# Altium schematic sheet 14_GPIOs_1.SchDoc: Apalis Evaluation Board 1.1
size A3; Organization: Toradex AG; Address1: Altsagenstrasse 5; Address2: Horw; Address3: 6048; Address4: Switzerland; DocumentNumber: 10; Revision: V1.1; SheetNumber: 10; SheetTotal: 32; PageSetup: Record=PageOptions|CenterHorizontal=True|CenterVertical=True|PrintScale=0.73|XCorrection=1.00|YCorrection=1.00|PrintKind=0|BorderSize=5000000|LeftOffset=0|BottomOffset=0|Orientation=2|PaperLength=1000|PaperWidth=1000|Scale=100|PaperSource=7|PrintQuality=-4|MediaType=1|DitherType=10|PaperKind=A4|PrintScaleMode=1
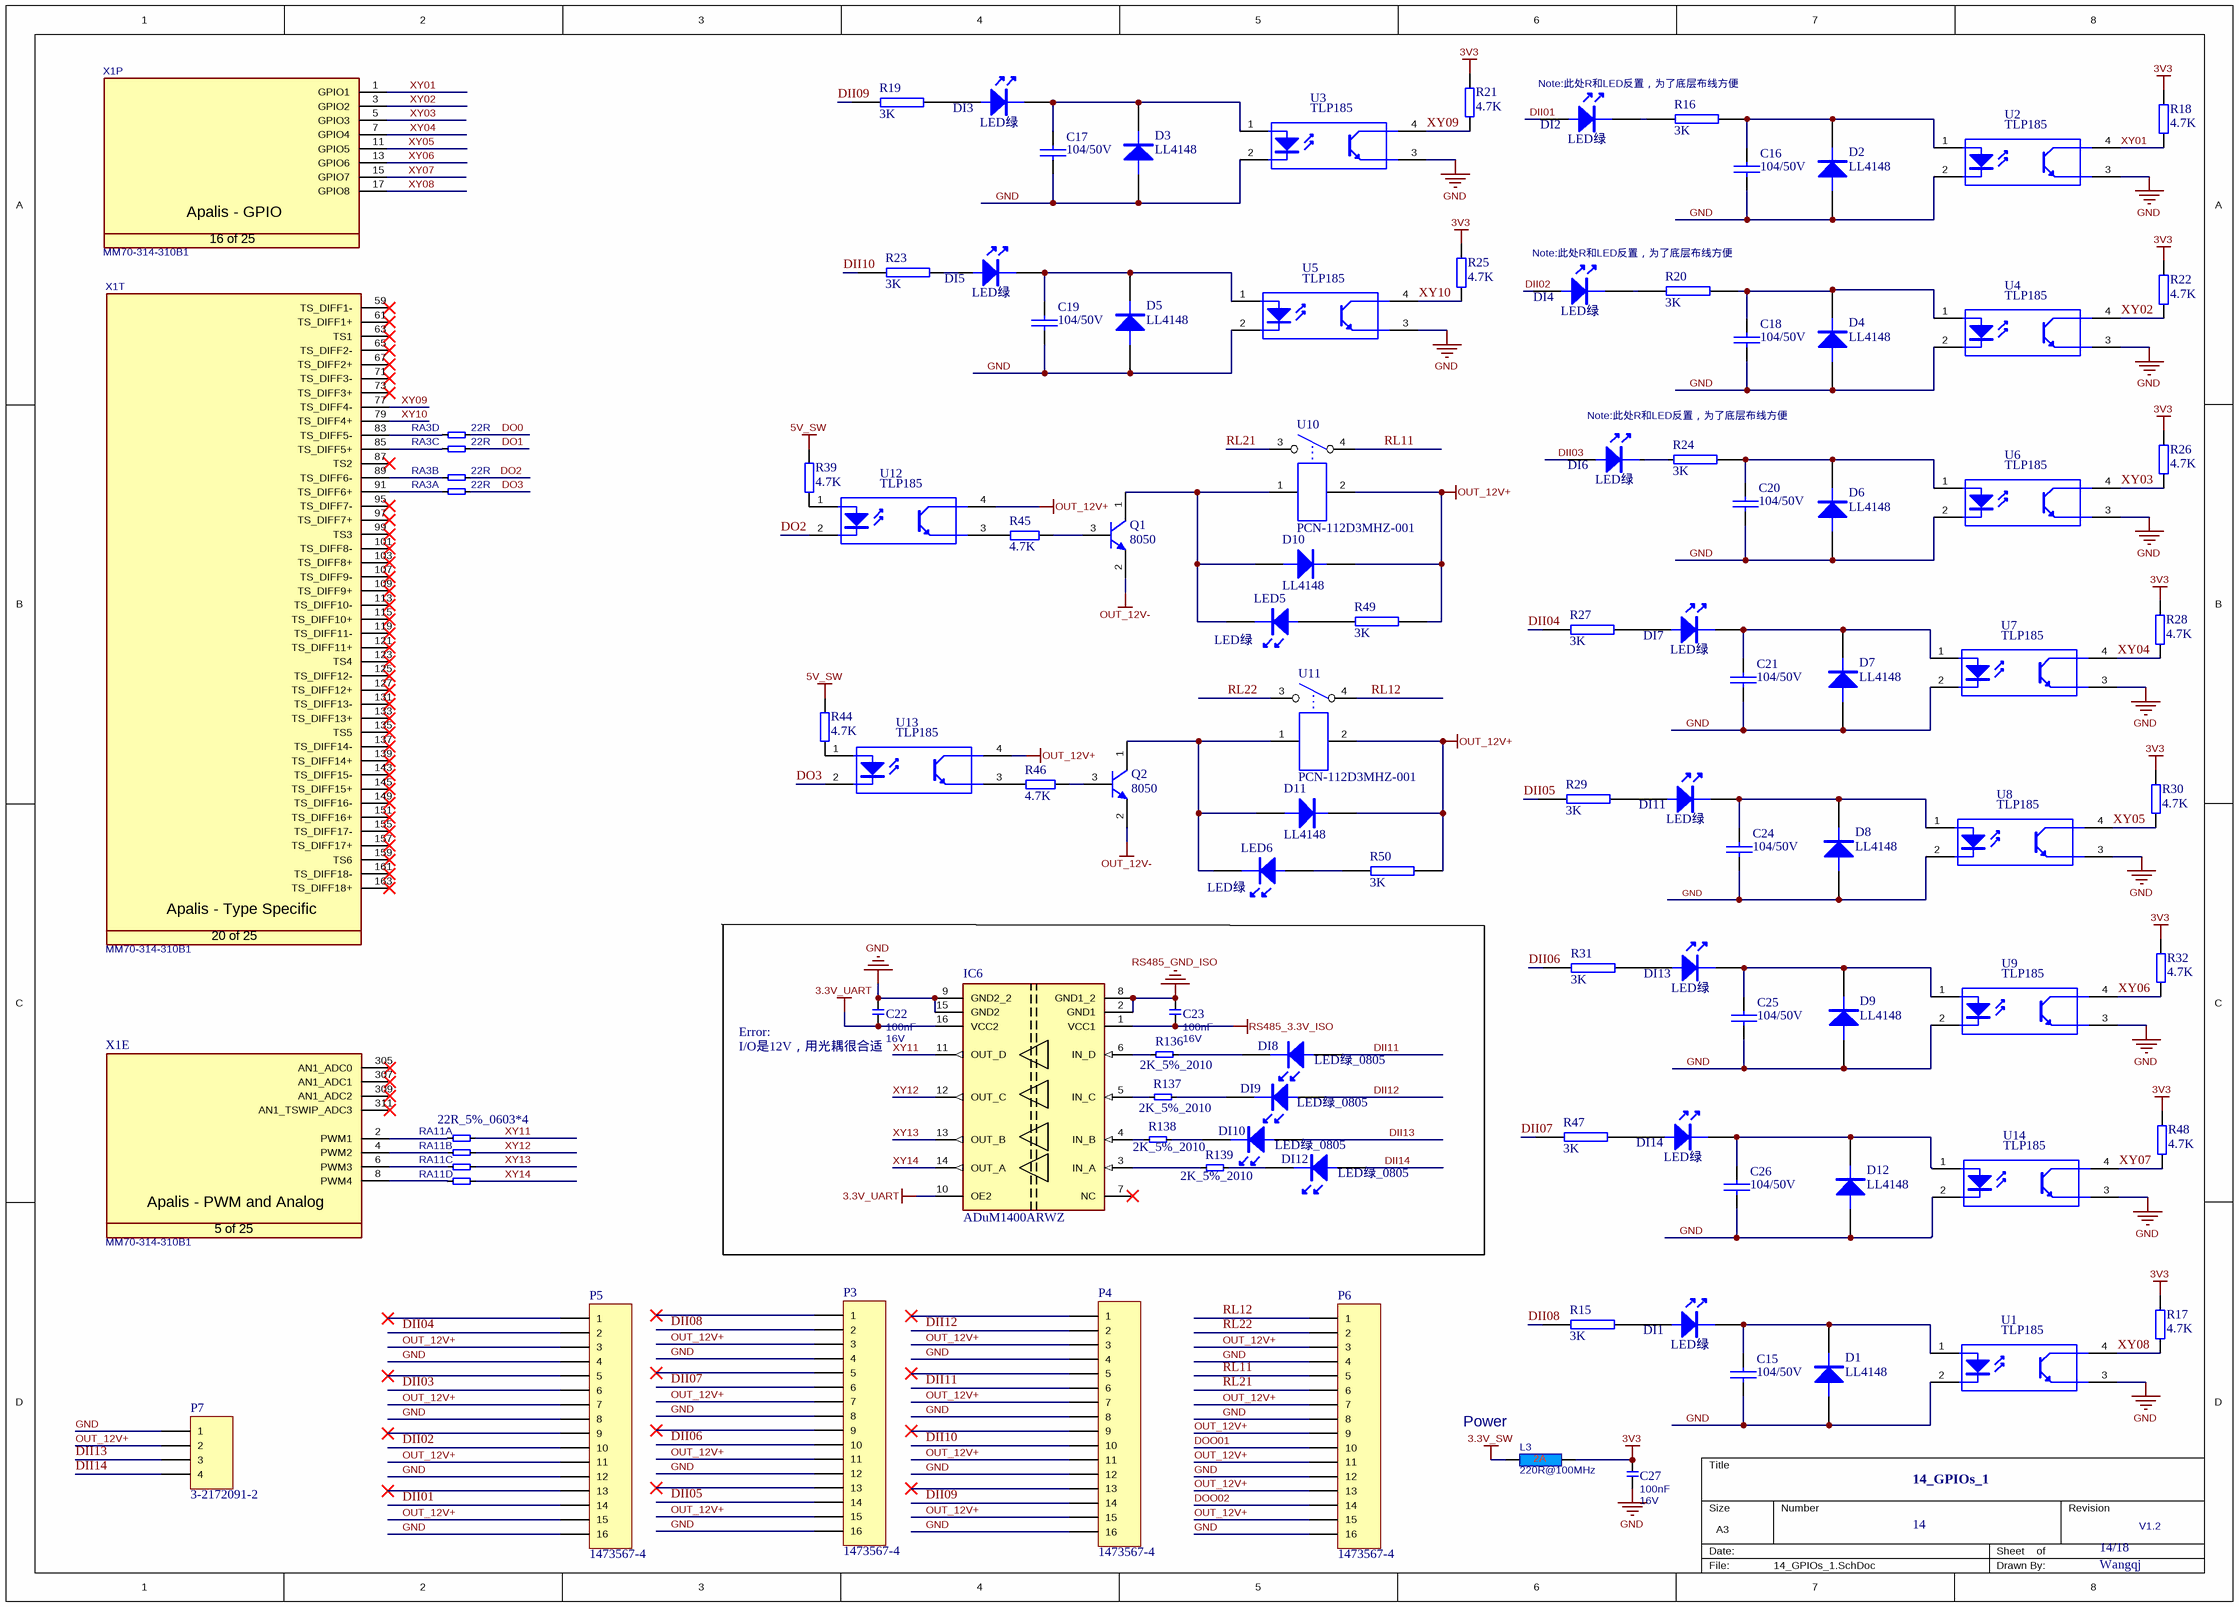
[diagram p0: 14_GPIOs_1.SchDoc]

## Parts
C15  104/50V  [0603c]
C16  104/50V  [0603c]
C17  104/50V  [0603c]
C18  104/50V  [0603c]
C19  104/50V  [0603c]
C20  104/50V  [0603c]
C21  104/50V  [0603c]
C22  Rating: 16V  [T_CAPC0603X33N]  (hidden comment: 100nF)
C23  Rating: 16V  [T_CAPC0603X33N]  (hidden comment: 100nF)
C24  104/50V  [0603c]
C25  104/50V  [0603c]
C26  104/50V  [0603c]
C27  Rating: 16V  [T_CAPC0603X33N]  (hidden comment: 100nF)
D1  LL4148  [3216]
D2  LL4148  [3216]
D3  LL4148  [3216]
D4  LL4148  [3216]
D5  LL4148  [3216]
D6  LL4148  [3216]
D7  LL4148  [3216]
D8  LL4148  [3216]
D9  LL4148  [3216]
D10  LL4148  [3216]
D11  LL4148  [3216]
D12  LL4148  [3216]
DI1  LED绿  [LC-0805_LED_S3]
DI2  LED绿  [LC-0805_LED_S3]
DI3  LED绿  [LC-0805_LED_S3]
DI4  LED绿  [LC-0805_LED_S3]
DI5  LED绿  [LC-0805_LED_S3]
DI6  LED绿  [LC-0805_LED_S3]
DI7  LED绿  [LC-0805_LED_S3]
DI8  LED绿_0805  [LC-0805_LED_S3]
DI9  LED绿_0805  [LC-0805_LED_S3]
DI10  LED绿_0805  [LC-0805_LED_S3]
DI11  LED绿  [LC-0805_LED_S3]
DI12  LED绿_0805  [LC-0805_LED_S3]
DI13  LED绿  [LC-0805_LED_S3]
DI14  LED绿  [LC-0805_LED_S3]
IC6  ADuM1400ARWZ  [T_AD_ADuM1300ARW]
L3  220R@100MHz  [INDC1608X95N]
LED5  LED绿  [LC-0805_LED_S3]
LED6  LED绿  [LC-0805_LED_S3]
P3  1473567-4  [147-4]
P4  1473567-4  [147-4]
P5  1473567-4  [147-4]
P6  1473567-4  [147-4]
P7  3-2172091-2  [M12弯角座]
Q1  8050  [SOT-23M]
Q2  8050  [SOT-23M]
R15  3K  [2010]
R16  3K  [2010]
R17  4.7K  [0603R]
R18  4.7K  [0603R]
R19  3K  [2010]
R20  3K  [2010]
R21  4.7K  [0603R]
R22  4.7K  [0603R]
R23  3K  [2010]
R24  3K  [2010]
R25  4.7K  [0603R]
R26  4.7K  [0603R]
R27  3K  [2010]
R28  4.7K  [0603R]
R29  3K  [2010]
R30  4.7K  [0603R]
R31  3K  [2010]
R32  4.7K  [0603R]
R39  4.7K  [0603R]
R44  4.7K  [0603R]
R45  4.7K  [0603R]
R46  4.7K  [0603R]
R47  3K  [2010]
R48  4.7K  [0603R]
R49  3K  [1206]
R50  3K  [1206]
R136  2K_5%_2010  [2010]
R137  2K_5%_2010  [2010]
R138  2K_5%_2010  [2010]
R139  2K_5%_2010  [2010]
RA3  22R  [T_Resistor_Array_X4]  (parts A,B,C,D of 4)
RA11  22R_5%_0603*4  [T_Resistor_Array_X4]  (parts A,B,C,D of 4)
U1  TLP185  [SO_PHT-4]
U2  TLP185  [SO_PHT-4]
U3  TLP185  [SO_PHT-4]
U4  TLP185  [SO_PHT-4]
U5  TLP185  [SO_PHT-4]
U6  TLP185  [SO_PHT-4]
U7  TLP185  [SO_PHT-4]
U8  TLP185  [SO_PHT-4]
U9  TLP185  [SO_PHT-4]
U10  PCN-112D3MHZ-001  [CRH-1C]
U11  PCN-112D3MHZ-001  [CRH-1C]
U12  TLP185  [SO_PHT-4]
U13  TLP185  [SO_PHT-4]
U14  TLP185  [SO_PHT-4]
X1  Manufacturer Part No.: MM70-314-310B1  [T_JAE_MM70-314-310B1]  (hidden comment: CON-JAE-MM70-314-310B1-314-0.5mm)  (parts E,P,T of 25)

## Nets
3.3V_SW: L3.1
3.3V_UART: C22.2 IC6.10(OE2) IC6.16(VCC2)
3V3: C27.2 L3.2 R17.2 R18.2 R21.2 R22.2 R25.2 R26.2 R28.2 R30.2 R32.2 R48.2
5V_SW: R39.1 R44.1
GND: C15.2 C16.2 C17.2 C18.2 C19.2 C20.2 C21.2 C22.1 C24.2 C25.2 C26.2 C27.1 D1.1 D2.1 D3.1 D4.1 D5.1 D6.1 D7.1 D8.1 D9.1 D12.1 IC6.9(GND2_2) IC6.15(GND2) P3.4 P3.8 P3.12 P3.16 P4.4 P4.8 P4.12 P4.16 P5.4 P5.8 P5.12 P5.16 P6.4 P6.8 P6.12 P6.16 P7.1 U1.2(K) U1.3(E) U2.2(K) U2.3(E) U3.2(K) U3.3(E) U4.2(K) U4.3(E) U5.2(K) U5.3(E) U6.2(K) U6.3(E) U7.2(K) U7.3(E) U8.2(K) U8.3(E) U9.2(K) U9.3(E) U14.2(K) U14.3(E)
OUT_12V+: D10.2 D11.2 P3.3 P3.7 P3.11 P3.15 P4.3 P4.7 P4.11 P4.15 P5.3 P5.7 P5.11 P5.15 P6.3 P6.7 P6.9 P6.11 P6.13 P6.15 P7.2 R49.1 R50.1 U10.2 U11.2 U12.4(C) U13.4(C)
OUT_12V-: Q1.2(E) Q2.2(E)
RS485_3.3V_ISO: C23.2 IC6.1(VCC1)
RS485_GND_ISO: C23.1 IC6.2(GND1) IC6.8(GND1_2)
DII01: DI2.A P5.14
DII02: DI4.A P5.10
DII03: DI6.A P5.6
DII04: P5.2 R27.1
DII05: P3.14 R29.1
DII06: P3.10 R31.1
DII07: P3.6 R47.1
DII08: P3.2 R15.1
DII09: P4.14 R19.1
DII10: P4.10 R23.1
DII11: DI8.A P4.6
DII12: DI9.A P4.2
DII13: DI10.A P7.3
DII14: DI12.A P7.4
DO0: RA3.8
DO1: RA3.7
DO2: RA3.6 U12.2(K)
DO3: RA3.5 U13.2(K)
DOO01: P6.10
DOO02: P6.14
RL11: P6.5 U10.4
RL12: P6.1 U11.4
RL21: P6.6 U10.3
RL22: P6.2 U11.3
XY01: R18.1 U2.4(C) X1.1(GPIO1)
XY02: R22.1 U4.4(C) X1.3(GPIO2)
XY03: R26.1 U6.4(C) X1.5(GPIO3)
XY04: R28.1 U7.4(C) X1.7(GPIO4)
XY05: R30.1 U8.4(C) X1.11(GPIO5)
XY06: R32.1 U9.4(C) X1.13(GPIO6)
XY07: R48.1 U14.4(C) X1.15(GPIO7)
XY08: R17.1 U1.4(C) X1.17(GPIO8)
XY09: R21.1 U3.4(C) X1.77(TS_DIFF4-)
XY10: R25.1 U5.4(C) X1.79(TS_DIFF4+)
XY11: IC6.11(OUT_D) RA11.5
XY12: IC6.12(OUT_C) RA11.6
XY13: IC6.13(OUT_B) RA11.7
XY14: IC6.14(OUT_A) RA11.8
NetC15_1: C15.1 D1.2 DI1.K U1.1(A)
NetC16_1: C16.1 D2.2 R16.2 U2.1(A)
NetC17_1: C17.1 D3.2 DI3.K U3.1(A)
NetC18_1: C18.1 D4.2 R20.2 U4.1(A)
NetC19_1: C19.1 D5.2 DI5.K U5.1(A)
NetC20_1: C20.1 D6.2 R24.2 U6.1(A)
NetC21_1: C21.1 D7.2 DI7.K U7.1(A)
NetC24_1: C24.1 D8.2 DI11.K U8.1(A)
NetC25_1: C25.1 D9.2 DI13.K U9.1(A)
NetC26_1: C26.1 D12.2 DI14.K U14.1(A)
NetD10_1: D10.1 LED5.K Q1.1(C) U10.1
NetD11_1: D11.1 LED6.K Q2.1(C) U11.1
NetDI1_A: DI1.A R15.2
NetDI2_K: DI2.K R16.1
NetDI3_A: DI3.A R19.2
NetDI4_K: DI4.K R20.1
NetDI5_A: DI5.A R23.2
NetDI6_K: DI6.K R24.1
NetDI7_A: DI7.A R27.2
NetDI8_K: DI8.K R136.2
NetDI9_K: DI9.K R137.2
NetDI10_K: DI10.K R138.2
NetDI11_A: DI11.A R29.2
NetDI12_K: DI12.K R139.2
NetDI13_A: DI13.A R31.2
NetDI14_A: DI14.A R47.2
NetIC6_3: IC6.3(IN_A) R139.1
NetIC6_4: IC6.4(IN_B) R138.1
NetIC6_5: IC6.5(IN_C) R137.1
NetIC6_6: IC6.6(IN_D) R136.1
NetLED5_A: LED5.A R49.2
NetLED6_A: LED6.A R50.2
NetQ1_3: Q1.3(B) R45.1
NetQ2_3: Q2.3(B) R46.1
NetR39_2: R39.2 U12.1(A)
NetR44_2: R44.2 U13.1(A)
NetR45_2: R45.2 U12.3(E)
NetR46_2: R46.2 U13.3(E)
NetRA3_1: RA3.1 X1.91(TS_DIFF6+)
NetRA3_2: RA3.2 X1.89(TS_DIFF6-)
NetRA3_3: RA3.3 X1.85(TS_DIFF5+)
NetRA3_4: RA3.4 X1.83(TS_DIFF5-)
NetRA11_1: RA11.1 X1.2(PWM1)
NetRA11_2: RA11.2 X1.4(PWM2)
NetRA11_3: RA11.3 X1.6(PWM3)
NetRA11_4: RA11.4 X1.8(PWM4)

Not connected (* = marked no-connect by the designer): IC6 7(NC)*; P3 1* 5* 9* 13*; P4 1* 5* 9* 13*; P5 1* 5* 9* 13*; X1 59(TS_DIFF1-)* 61(TS_DIFF1+)* 63(TS1)* 65(TS_DIFF2-)* 67(TS_DIFF2+)* 71(TS_DIFF3-)* 73(TS_DIFF3+)* 87(TS2)* 95(TS_DIFF7-)* 97(TS_DIFF7+)* 99(TS3)* 101(TS_DIFF8-)* 103(TS_DIFF8+)* 107(TS_DIFF9-)* 109(TS_DIFF9+)* 113(TS_DIFF10-)* 115(TS_DIFF10+)* 119(TS_DIFF11-)* 121(TS_DIFF11+)* 123(TS4)* 125(TS_DIFF12-)* 127(TS_DIFF12+)* 131(TS_DIFF13-)* 133(TS_DIFF13+)* 135(TS5)* 137(TS_DIFF14-)* 139(TS_DIFF14+)* 143(TS_DIFF15-)* 145(TS_DIFF15+)* 149(TS_DIFF16-)* 151(TS_DIFF16+)* 155(TS_DIFF17-)* 157(TS_DIFF17+)* 159(TS6)* 161(TS_DIFF18-)* 163(TS_DIFF18+)* 305(AN1_ADC0)* 307(AN1_ADC1)* 309(AN1_ADC2)* 311(AN1_TSWIP_ADC3)*

## Notes on the sheet
- Note:此处R和LED反置，为了底层布线方便
- Error:
- (near C22) I/O是12V，用光耦很合适
- (near L3) Power
- 14_GPIOs_1
- 14
- 14/18
- V1.2
- Wangqj
- Title
- Size:
- Date:
- A3
- Number:
- Time:
- Revision:
- Sheet
- of
- File:
- (in symbol CON-JAE-MM70-314-310B1-314-0.5mm, part E) Apalis - PWM and Analog; 5 of 25
- (in symbol CON-JAE-MM70-314-310B1-314-0.5mm, part P) Apalis - GPIO; 16 of 25
- (in symbol CON-JAE-MM70-314-310B1-314-0.5mm, part T) Apalis - Type Specific; 20 of 25

## Library data of the parts
C15-C21 C24-C26 = CAP: 贴片电容
C22 C23 C27 = C-100nF-16V-10%-0603-X7R: Capacitor Ceramic X7R 100nF 16V 10% 0603; Tolerance: 10%; Type: X7R; Value: 100nF
D1-D9 D12 = DIODE: 贴片二极管
D10 D11 = DIODE
DI1-DI14 LED5 LED6 = LED: 0805LED绿
IC6 = IC-AD-ADuM1400ARWZ: Digital Isolator 4IN
L3 = L-220R@100MHz-2A-25%-0603: 220R@100MHz 2A EMI FILTER; Tolerance: 25%; Rating: 2A; Value: 220R@100MHz
P3 P4 = Header 16H: 泰科4P端子; LatestRevisionDate: 17-Jul-2002; LatestRevisionNote: Re-released for DXP Platform.; Publisher: Altium Limited
P5 P6 = Header 16H: 泰科4p端子; LatestRevisionDate: 17-Jul-2002; LatestRevisionNote: Re-released for DXP Platform.; Publisher: Altium Limited
P7 = Header 4H: 泰科M8端子; LatestRevisionDate: 17-Jul-2002; LatestRevisionNote: Re-released for DXP Platform.; Publisher: Altium Limited
Q1 Q2 = NPN: 贴片三极管
R15 R16 R19 R20 R23 R24 R27 R29 R31 R47 R49 R50 = RES2: 贴片电阻
R17 R18 R21 R22 R25 R26 R28 R30 R32 R39 R44-R46 R48 = RES: 贴片电阻
R136-R138 = R-2KR-500mW-5%-2010: Resistor 2 Kohm 500mW 5% 2010; Rating: 63mW; Value: 2KR; Tolerance: 5%
R139 = R-2KR-500mW-5%-2010: Rating: 63mW; Tolerance: 5%; Value: 2KR
RA3 = RA-22R-63mW-5%-1206-div: Resistor Array 22 R 63mW 5% 1206; Tolerance: 5%; Power Dissipation: 63mW; Value: 22R
RA11 = RA-22R-63mW-5%-1206-div: Tolerance: 5%; Power Dissipation: 63mW; Value: 22R
U1-U9 U12-U14 = OPTOISO1: 光耦
U10 U11 = CRH-1C-DC12V: 泰科继电器
X1 = CON-JAE-MM70-314-310B1-314-0.5mm: MXM3 Connector; Manufacturer Name: JAE; No. of ways: 314